# Altium schematic sheet Generator28.SchDoc
size 420 x 297 mm; DocumentNumber: Audio core
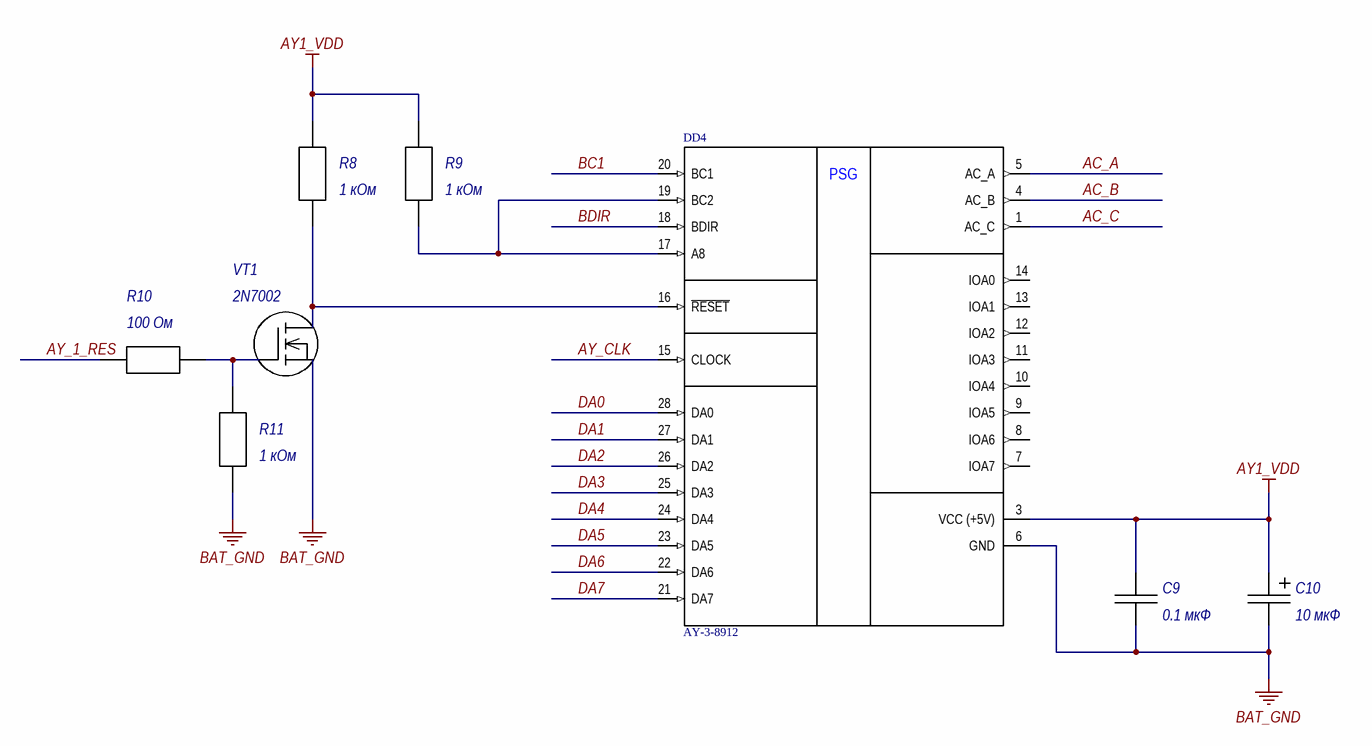
[diagram p0: Generator28.SchDoc]

## Parts
C9  0.1 мкФ  [C 1206]
C10  10 мкФ  [C TAN_A]
DD4  AY-3-8912  [DIP28_PLUS_MCU]
R8  1 кОм  [RES 0805]
R9  1 кОм  [RES 0805]
R10  100 Ом  [RES 0805]
R11  1 кОм  [RES 0805]
VT1  2N7002  [SOT-23]

## Nets
AY1_VDD: C9.1 C10.1 DD4.3(VCC_(+5V)) R8.2 R9.1
BAT_GND: C9.2 C10.2 DD4.6(GND) R11.1 VT1.2(S)
AC_A: DD4.5(AC_A)
AC_B: DD4.4(AC_B)
AC_C: DD4.1(AC_C)
AY_1_RES: R10.1
AY_CLK: DD4.15(CLOCK)
BC1: DD4.20(BC1)
BDIR: DD4.18(BDIR)
DA0: DD4.28(DA0)
DA1: DD4.27(DA1)
DA2: DD4.26(DA2)
DA3: DD4.25(DA3)
DA4: DD4.24(DA4)
DA5: DD4.23(DA5)
DA6: DD4.22(DA6)
DA7: DD4.21(DA7)
NetDD4_16: DD4.16(~{RESET}) R8.1 VT1.3(D)
NetDD4_17: DD4.17(A8) DD4.19(BC2) R9.2
NetR10_2: R10.2 R11.2 VT1.1(G)

Not connected (* = marked no-connect by the designer): DD4 7(IOA7) 8(IOA6) 9(IOA5) 10(IOA4) 11(IOA3) 12(IOA2) 13(IOA1) 14(IOA0)

## Notes on the sheet
- Подп. и дата
- Инв. № дубл.
- Взам. инв. №
- Инв. № подл.
- Лист
- Изм.
- № докум.
- Подп.
- Дата
- Копировал
- Формат А3
- (in symbol AY-3-8912) PSG

## Library data of the parts
C9 = CAP 1206: SMD Capacitor 1206; Manufacturer: /Укажите компанию-производителя/; Tolerance: /Укажите допуск в процентах/; Temperature coefficient: /Формат: ±? ppm/°C/; Type: Конденсатор керамический; TC: /Укажите тип диэлектрика/; Size: 1206; Temperature range: /Формат: -? ... ? °C/; Value: 0.1 мкФ
C10 = CAP TAN_A: SMD Tantalium Capacitor A; Type: Конденсатор танталовый; Rated voltage: 10 В; Size: A
R8-R11 = RES 0805
VT1 = 2N7002: 60 V, 300 mA N-channel Trench MOSFET; Manufacturer: NXP; Structure: Индуцированный канал n-типа; Type: Транзистор полевой с изолированным затвором; Max gate-to-source voltage: 30 В; Drain-to-source breakdown voltage: 60 В; Gate threshold voltage: 2 В; Max continuous drain current: 300 мА; Max pulsed drain current: 1,2 А; Power dissitipation: 0,83 Вт; Input capacitance: 31 пФ; Output capacitance: 6,8 пФ; Turn-on time: 2,5 нс; Reverse transfer capacitance: 3,5 пФ; Turn-off time: 11 нс; Rds: 2,8 Ом; Temperature range: -65 ... 150 °C